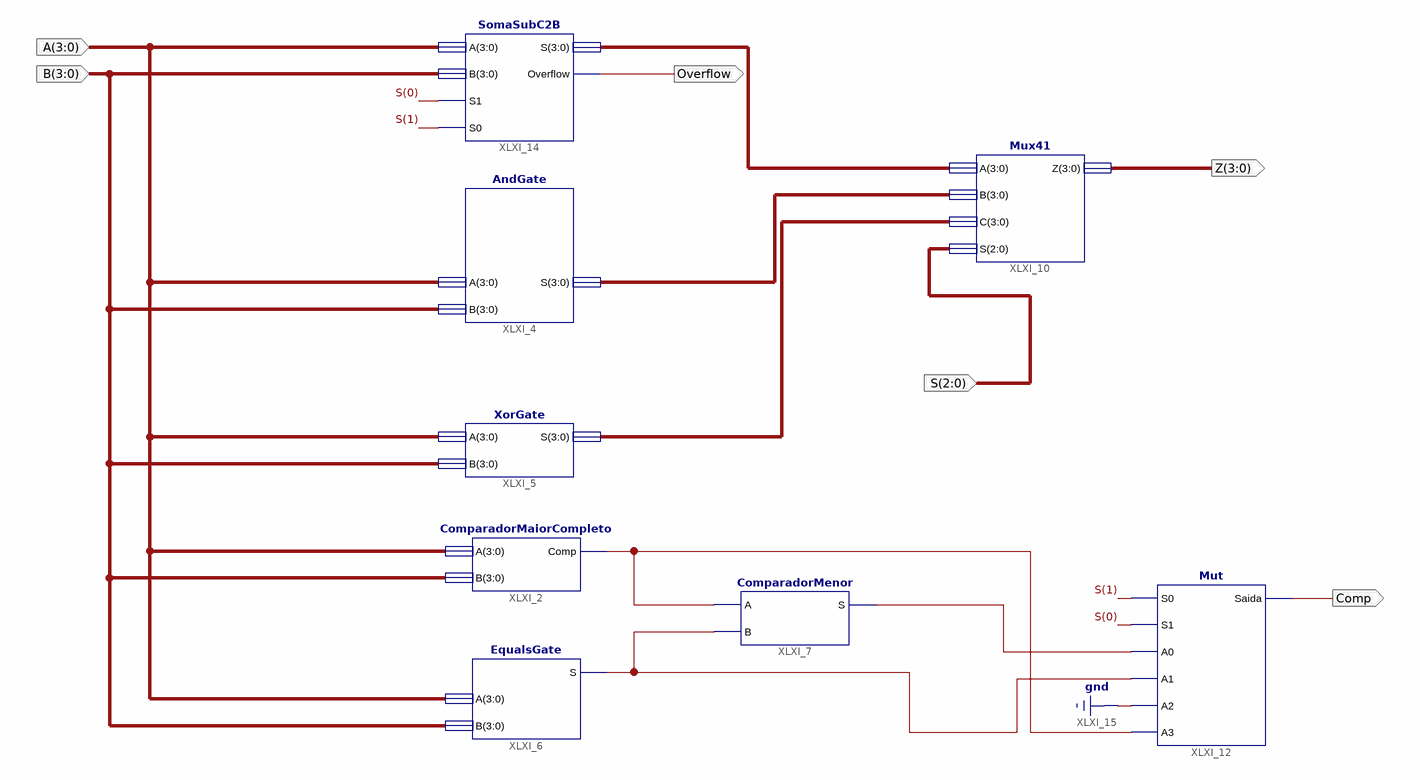
[diagram p0: schematic sheet 1]
// Xilinx ISE schematic ULA.sch (xa9500xl) as structural Verilog: 8 symbols, 6 ports
module ULA (
  input  [3:0] A,
  input  [3:0] B,
  input  [2:0] S,
  output [3:0] Z,
  output Overflow,
  output Comp
);

  wire XLXN_34, XLXN_36, XLXN_38;
  wire [3:0] XLXN_29, XLXN_30, XLXN_31;

  AndGate XLXI_4 (.A(A), .B(B), .S(XLXN_30));
  XorGate XLXI_5 (.A(A), .B(B), .S(XLXN_31));
  ComparadorMaiorCompleto XLXI_2 (.A(A), .B(B), .Comp(XLXN_38));
  EqualsGate XLXI_6 (.A(A), .B(B), .S(XLXN_34));
  ComparadorMenor XLXI_7 (.A(XLXN_38), .B(XLXN_34), .S(XLXN_36));
  Mux41 XLXI_10 (.A(XLXN_29), .B(XLXN_30), .C(XLXN_31), .S(S), .Z(Z));
  Mut XLXI_12 (.S0(S[1]), .S1(S[0]), .A0(XLXN_36), .A1(XLXN_34), .A2(1'b0), .A3(XLXN_38), .Saida(Comp));
  SomaSubC2B XLXI_14 (.S0(S[1]), .A(A), .B(B), .S1(S[0]), .S(XLXN_29), .Overflow(Overflow));
endmodule
